# Altium schematic sheet 05_GAP_MIC.SchDoc: SENSEI Base Board - GAP MIC
size A3; DrawnBy: Sebastian Frey; Organization: Integrated Systems Laboratory; DocumentNumber: 6; Revision: v1.0; SheetNumber: 6; SheetTotal: 12
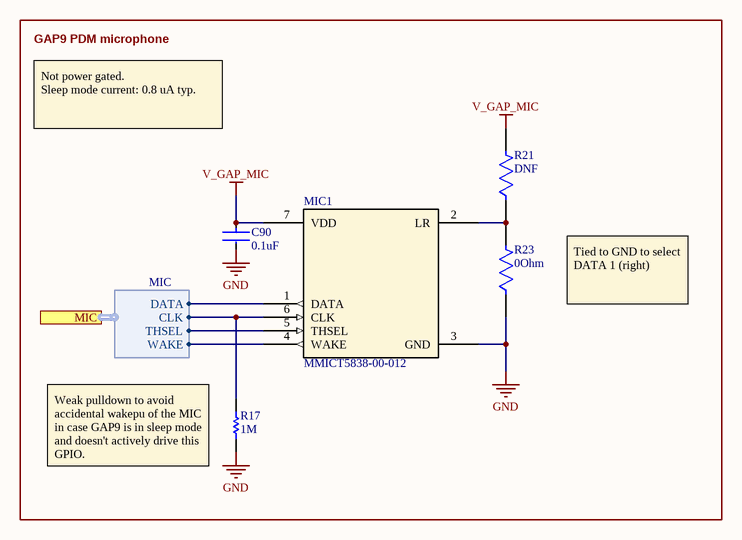
[diagram p0: 05_GAP_MIC.SchDoc]

## Parts
C90  Capacitance: 0.1uF  [FP-GRM033-0_03-IPC_B]  (hidden comment: GRM033Z71C104KE14D)
MIC1  MMICT5838-00-012  [MMICT5838-00-012]
R17  value 1M  [RESC0201(0603)_L]  (hidden comment: ERJ-1GNJ105C)
R21  DNF  [FP-RMCF0201-IPC_C]
R23  Resistance: 0Ohm  [FP-RMCF0201-IPC_C]  (hidden comment: RMCF0201ZT0R00)

## Blocks framed on the sheet
GAP9 PDM microphone: C90 MIC1 R17 R21 R23

## Ports
MIC (harness MIC)

## Harnesses
MIC: DATA, THSEL, WAKE, CLK

## Nets
GND: C90.2 MIC1.3(GND) R17.1 R23.1
V_GAP_MIC: C90.1 MIC1.7(VDD) R21.2
NetMIC1_1: MIC1.1(DATA) ; port MIC.DATA
NetMIC1_2: MIC1.2(LR) R21.1 R23.2
NetMIC1_4: MIC1.4(WAKE) ; port MIC.WAKE
NetMIC1_5: MIC1.5(THSEL) ; port MIC.THSEL
NetMIC1_6: MIC1.6(CLK) R17.2 ; port MIC.CLK

## Notes on the sheet
- Not power gated.
  Sleep mode current: 0.8 uA typ.
- Tied to GND to select DATA 1 (right)
- (near R17) Weak pulldown to avoid accidental wakepu of the MIC in case GAP9 is in sleep mode and doesn't actively drive this GPIO.
- 1
- 2
- 3
- 4
- 5
- 6
- 7
- 8
- A
- B
- C
- D
- Project:
- Date:
- Drawing number:
- Rev:
- Format:
- A3
- Drawn by:
- Laboratory:
- Page
- Sheet:
- of
- File:

## Library data of the parts
C90 = CMP-06035-035508-1: Chip Multilayer Ceramic Capacitors for General Purpose, 0201, 0.10uF, X7R, 15%, 10%, 16V; Case/Package: 0201
MIC1 = MMICT5838-00-012: No Description Available; Mfr_Name: InvenSense; Copyright: Copyright (C) 2023 Ultra Librarian. All rights reserved.; Manufacturer_Part_Number: MMICT5838-00-012; RefDes: RefDes; Type: DEV
R17 = CMP-1010-00146-1: 1M 0.05W 5% 0201 (0603 Metric)  SMD; Case-Metric: 0603; Case-EIA: 0201; Technology: SMT; Tolerance: 5 %; Power: 0.05 W
R21 = CMP-26527-001890-1
R23 = CMP-26527-001890-1: 0Ω ±0 0.05W 0201 Thick Film Chip Resistor AEC-Q200 compliant; Max Power Dissipation: 50mW; Packaging: Tape and Reel; Case/Package: 0201; Lead Free: Lead Free; Mount: Surface Mount; Series: RMCF; Power Rating: 50mW; Max Operating Temperature: 125°C; Resistor Type: Thick Film; Height - Seated (Max): 0.01inch; Package Quantity: 10000; RoHS Compliant: Yes; Case Code (Metric): 0603; Height: 0.009inch; Radiation Hardening: No; Case Code (Imperial): 0201; Number of Terminations: 2; Contact Plating: Tin; Width: 0.012inch; Min Operating Temperature: -55°C; Length: 0.024inch